# Altium schematic sheet button.SchDoc
size A4
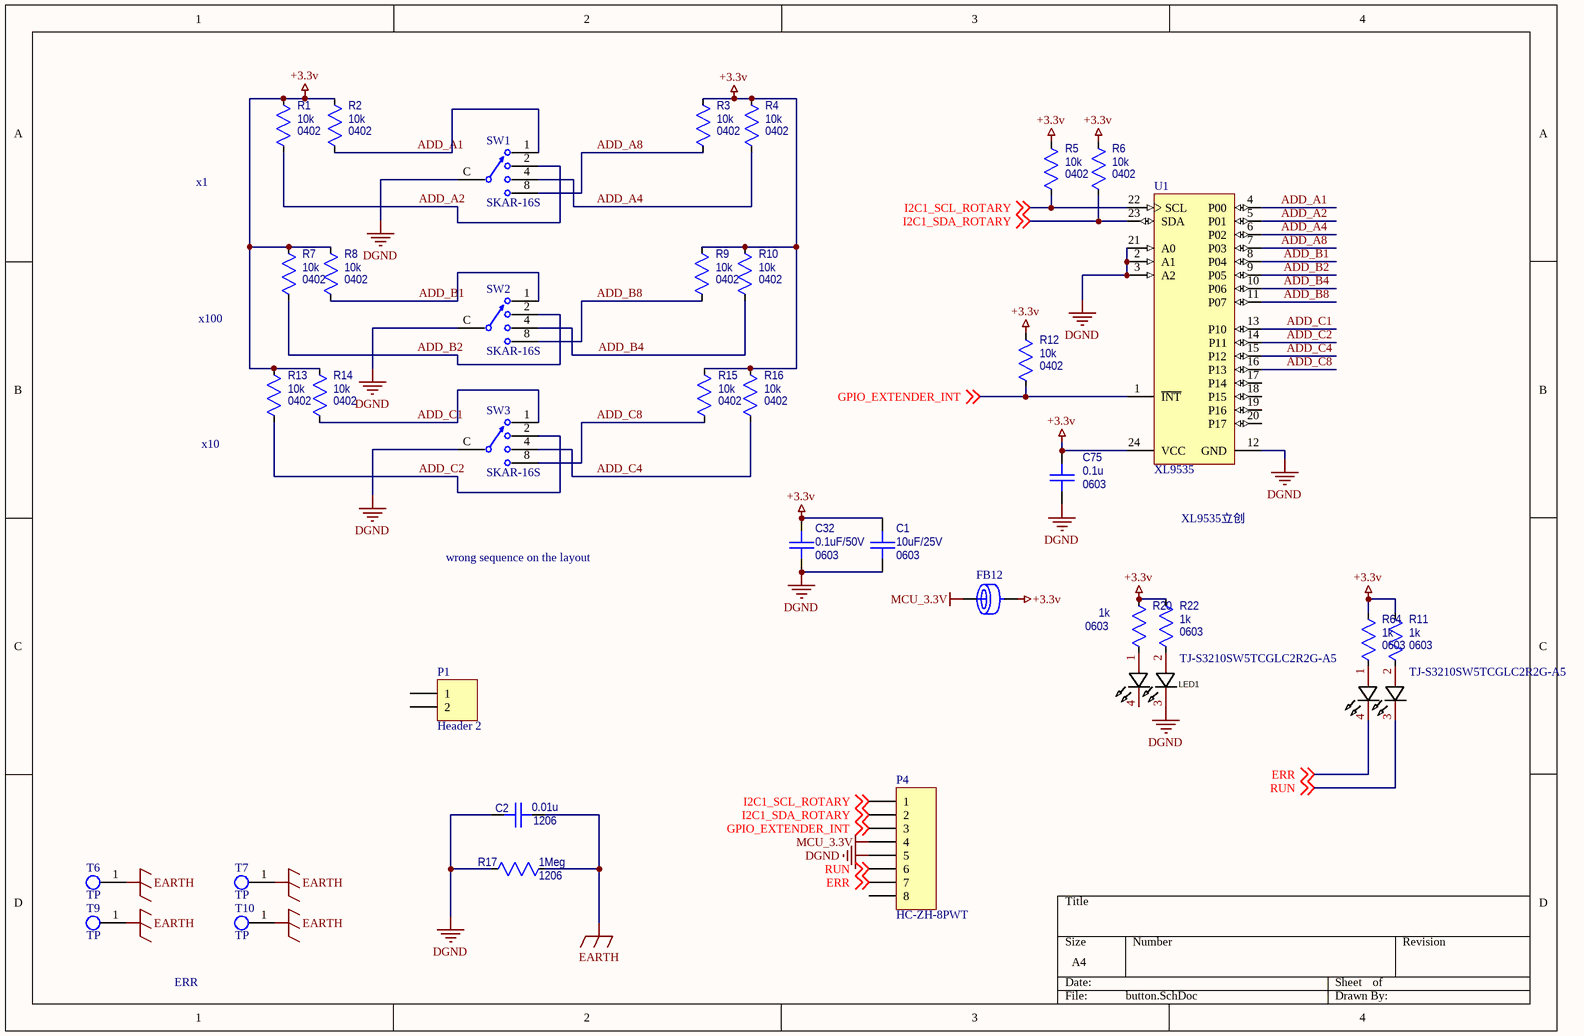
[diagram p0: button.SchDoc]

## Parts
C1  value 10uF/25V  Package: 0603  [CAPC1608X092N_0603]  (hidden comment: Capacitor_0603)
C2  value 0.01u  Package: 1206  [CAPC3216X156N_1206]  (hidden comment: Capacitor_1206)
C32  value 0.1uF/50V  Package: 0603  [CAPC1608X092N_0603]  (hidden comment: Capacitor_0603)
C75  value 0.1u  Package: 0603  [CAPC1608X092N_0603]  (hidden comment: Capacitor_0603)
FB12  FBC0603  [FBC0603]  (value not drawn)
LED1  TJ-S3210SW5TCGLC2R2G-A5  [LED-SMD_4P-L3.2-W1.5_TJ-S3210SW5TCGLC2R2G]
LED2  TJ-S3210SW5TCGLC2R2G-A5  [LED-SMD_4P-L3.2-W1.5_TJ-S3210SW5TCGLC2R2G]
P1  Header 2  [HDR1X2]
P4  HC-ZH-8PWT  [CONN-TH_HC-ZH1.5-8A]
R1  value 10k  Package: 0402  [RESC1608X055N_0603]  (hidden comment: Resistor_0402)
R2  value 10k  Package: 0402  [RESC1608X055N_0603]  (hidden comment: Resistor_0402)
R3  value 10k  Package: 0402  [RESC1608X055N_0603]  (hidden comment: Resistor_0402)
R4  value 10k  Package: 0402  [RESC1608X055N_0603]  (hidden comment: Resistor_0402)
R5  value 10k  Package: 0402  [RESC1608X055N_0603]  (hidden comment: Resistor_0402)
R6  value 10k  Package: 0402  [RESC1608X055N_0603]  (hidden comment: Resistor_0402)
R7  value 10k  Package: 0402  [RESC1608X055N_0603]  (hidden comment: Resistor_0402)
R8  value 10k  Package: 0402  [RESC1608X055N_0603]  (hidden comment: Resistor_0402)
R9  value 10k  Package: 0402  [RESC1608X055N_0603]  (hidden comment: Resistor_0402)
R10  value 10k  Package: 0402  [RESC1608X055N_0603]  (hidden comment: Resistor_0402)
R11  value 1k  Package: 0603  [RESC1608X055N_0603]  (hidden comment: Resistor_0603)
R12  value 10k  Package: 0402  [RESC1608X055N_0603]  (hidden comment: Resistor_0402)
R13  value 10k  Package: 0402  [RESC1608X055N_0603]  (hidden comment: Resistor_0402)
R14  value 10k  Package: 0402  [RESC1608X055N_0603]  (hidden comment: Resistor_0402)
R15  value 10k  Package: 0402  [RESC1608X055N_0603]  (hidden comment: Resistor_0402)
R16  value 10k  Package: 0402  [RESC1608X055N_0603]  (hidden comment: Resistor_0402)
R17  value 1Meg  Package: 1206  [RESC3216X070N_1206]  (hidden comment: Resistor_1206)
R20  value 1k  Package: 0603  [RESC1608X055N_0603]  (hidden comment: Resistor_0603)
R22  value 1k  Package: 0603  [RESC1608X055N_0603]  (hidden comment: Resistor_0603)
R64  value 1k  Package: 0603  [RESC1608X055N_0603]  (hidden comment: Resistor_0603)
SW1  SKAR-16S  [SW-SMD_SM_STAR-10S]
SW2  SKAR-16S  [SW-SMD_SM_STAR-10S]
SW3  SKAR-16S  [SW-SMD_SM_STAR-10S]
T6  TP  [FIX-2.5]
T7  TP  [FIX-2.5]
T9  TP  [FIX-2.5]
T10  TP  [FIX-2.5]
U1  XL9535  [XNLD-TSSOP24_N]

## Nets
+3.3v: C1.1 C32.1 C75.1 FB12.2 R1.2 R2.2 R3.2 R4.2 R5.2 R6.2 R7.2 R8.2 R9.2 R10.2 R11.2 R12.2 R13.2 R14.2 R15.2 R16.2 R20.2 R22.2 R64.2 U1.24(VCC)
DGND: C1.2 C2.1 C32.2 C75.2 LED1.3(-) P4.5 R17.2 SW1.C SW2.C SW3.C U1.2(A1) U1.3(A2) U1.12(GND) U1.21(A0)
EARTH: C2.2 R17.1 T6.1 T7.1 T9.1 T10.1
MCU_3.3V: FB12.1 P4.4
ADD_A1: R2.1 SW1.1 U1.4(P00)
ADD_A2: R1.1 SW1.2 U1.5(P01)
ADD_A4: R4.1 SW1.4 U1.6(P02)
ADD_A8: R3.1 SW1.8 U1.7(P03)
ADD_B1: R8.1 SW2.1 U1.8(P04)
ADD_B2: R7.1 SW2.2 U1.9(P05)
ADD_B4: R10.1 SW2.4 U1.10(P06)
ADD_B8: R9.1 SW2.8 U1.11(P07)
ADD_C1: R14.1 SW3.1 U1.13(P10)
ADD_C2: R13.1 SW3.2 U1.14(P11)
ADD_C4: R16.1 SW3.4 U1.15(P12)
ADD_C8: R15.1 SW3.8 U1.16(P13)
ERR: LED2.4(-) P4.7 ; off-sheet ERR
GPIO_EXTENDER_INT: P4.3 R12.1 U1.1(~{INT}) ; off-sheet GPIO_EXTENDER_INT
I2C1_SCL_ROTARY: P4.1 R5.1 U1.22(SCL) ; off-sheet I2C1_SCL_ROTARY
I2C1_SDA_ROTARY: P4.2 R6.1 U1.23(SDA) ; off-sheet I2C1_SDA_ROTARY
RUN: LED2.3(-) P4.6 ; off-sheet RUN
NetLED1_1: LED1.1(+) R20.1
NetLED1_2: LED1.2(+) R22.1
NetLED2_1: LED2.1(+) R64.1
NetLED2_2: LED2.2(+) R11.1

Not connected (* = marked no-connect by the designer): LED1 4(-); P1 1 2; P4 8; U1 17(P14) 18(P15) 19(P16) 20(P17)

## Notes on the sheet
- x1
- x100
- x10
- wrong sequence on the layout
- XL9535立创
- ERR

## Library data of the parts
C1 C32 = Capacitor_0603: PartNumber: C0603C104M5RACTU; Tolerance: [tol]; TempCo: [tempco]; Voltage Rating: [voltage]; Power Rating: *; SupplierDescription: CAP CER 0.1UF 50V X7R 0603
C2 = Capacitor_1206: Capacitor, MLCC; PartNumber: C1206C103KCRACTU; Tolerance: [tol]; TempCo: [tempco]; Voltage Rating: [voltage]; ComponentLink1URL: *; 04 Lifecycle: *; ComponentLink1Description: Datasheet; SupplierDescription: CAP CER 10000PF 500V X7R 1206
C75 = Capacitor_0603: Capacitor, MLCC; Manufacturer: KEMET; PartNumber: C0603C104M5RACTU; Tolerance: [tol]; TempCo: [tempco]; Voltage Rating: [voltage]; ComponentLink1URL: *; Current Rating: *; ComponentLink1Description: Datasheet; Power Rating: *; SupplierDescription: CAP CER 0.1UF 50V X7R 0603
FB12 = FBC0603: PartNumber: PE-0603PFB121ST; Value: 600 Ohms @ 100MHz; SupplierDescription: FERRITE BEAD 600 OHM 0603 1LN
LED1 LED2 = TJ-S3210SW5TCGLC2R2G-A5: Add into BOM: yes; Forward Current: 20mA; Symbol: TJ-S3210SW5TCGLC2R2G-A5; Device: TJ-S3210SW5TCGLC2R2G-A5; Supplier Part: C601680; Manufacturer Part: TJ-S3210SW5TCGLC2R2G-A5; Supplier Footprint: SMD,1.5x3.2mm; JLCPCB Part Class: Extended Part; Datasheet: https://atta.szlcsc.com/upload/public/pdf/source/20200618/C601680_03E6561E1E751F1BA8F42F573334542B.pdf; Supplier: LCSC; Convert to PCB: yes; Diode Configuration: -; Color Temperature: -
P1 = Header 2: Header, 2-Pin; LatestRevisionDate: 17-Jul-2002; LatestRevisionNote: Re-released for DXP Platform.; Publisher: Altium Limited
P4 = Header 8: Header, 8-Pin; LatestRevisionDate: 17-Jul-2002; LatestRevisionNote: Re-released for DXP Platform.; Publisher: Altium Limited
R1-R10 R12-R16 = Resistor_0402: Resistor, Standard; Manufacturer: Panasonic; PartNumber: ERJ-2RKF1002X; Power Rating: [power]; TempCo: [tempco]; Tolerance: tol; ComponentLink1URL: *; ComponentLink1Description: Datasheet; SupplierDescription: RES SMD 10K OHM 1% 1/10W 0402
R11 R20 R22 R64 = Resistor_0603: Resistor, Standard; Manufacturer: Yageo; PartNumber: RC0603FR-071KL; Power Rating: [power]; TempCo: [tempco]; Tolerance: tol; ComponentLink1URL: *; ComponentLink1Description: Datasheet
  R11 R64: SupplierDescription: RES SMD 1K OHM 1% 1/10W 0603
  R20 R22: SupplierDescription: RES 1k OHM 1% 1/10W 0603
R17 = Resistor_1206: Resistor, Standard; PartNumber: RC1206FR-071ML; TempCo: [tempco]; Tolerance: tol; ComponentLink1URL: *; ComponentLink1Description: Datasheet; SupplierDescription: RES SMD 1M OHM 1% 1/4W 1206
SW1-SW3 = MSDR-16H1: Mini Rotary DIP Switch, 16 Postions, Right Angle Thru-Hole, -60 to 125 degC, 6-Pin THT, RoHS; Manufacturer: SUNGMUN ELECTRONICS; Part No: MSDR-16H1; Mounting: ThroughHole; Manufacturer URL: http://www.sungmun.co.kr/
U1 = XL9535: Remote 16-Bit I2C and SMBus Low-Power I/O Expander with Interrupt Output & Config. Registers, 2.3 to 5.5 V, -40 to 85 degC, 24-pin TSSOP, Green (RoHS & no Sb/Br); Manufacturer: XINLUDA; Max Frequency(kHz): 400; Voltage Nodes(V): 5.5, 3.6, 2.7, 2.5; SubFamily: I2C IO Expander; I2C Address: 0100 xxx; Vcc range(V): 2.5 to 5.5; Push-Pull I/O Type: Yes; VCC(Max)(V): 5.5; VCC(Min)(V): 2.5; fSCLK(Max)(MHz): 0.4; # of I/Os: 16; Reset Input: No; PartNumber: XL9535; PackageDescription: 24-Pin Thin Small Outline Package 0.65 mm Pitch; PackageReference: PW0024A; ComponentLink1URL: https://www.xinluda.com/; Mounting Technology: Surface Mount; DatasheetVersion: SCPS121D; Eco-Plan: Green (RoHS & no Sb/Br); Code_JEDEC: MO-153; Interrupt Output: Yes; PackageVersion: revG, Feb-2011; ComponentLink1Description: Manufacturer URL